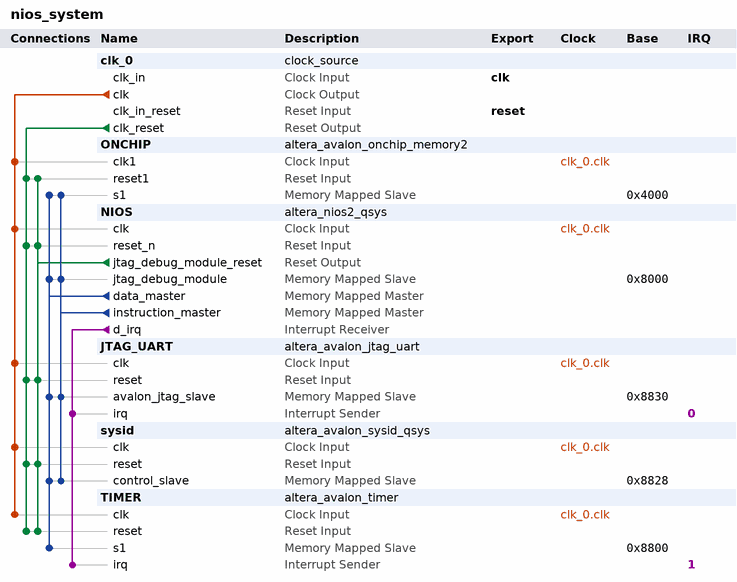
[diagram p0: system contents]
# Platform Designer (Qsys) system nios_system, Cyclone II EP2C20F484C7
# Parameters at their usual value, and those the tool derives, are not listed.
package require -exact qsys 13.0
create_system nios_system
set_project_property DEVICE_FAMILY {Cyclone II}
set_project_property DEVICE EP2C20F484C7

add_instance clk_0 clock_source 13.0
set_instance_parameter_value clk_0 clockFrequency 50000000

add_instance ONCHIP altera_avalon_onchip_memory2 13.0.1.99.2
set_instance_parameter_value ONCHIP dataWidth 32
set_instance_parameter_value ONCHIP dualPort false
set_instance_parameter_value ONCHIP initMemContent true
set_instance_parameter_value ONCHIP initializationFileName onchip_mem.hex
set_instance_parameter_value ONCHIP memorySize 16384

add_instance NIOS altera_nios2_qsys 13.0
set_instance_parameter_value NIOS resetSlave ONCHIP.s1
set_instance_parameter_value NIOS mmu_TLBMissExcSlave None
set_instance_parameter_value NIOS exceptionSlave ONCHIP.s1
set_instance_parameter_value NIOS breakSlave NIOS.jtag_debug_module
set_instance_parameter_value NIOS impl Fast
set_instance_parameter_value NIOS icache_size 2048

add_instance JTAG_UART altera_avalon_jtag_uart 13.0.1.99.2
set_instance_parameter_value JTAG_UART simInteractiveOptions NO_INTERACTIVE_WINDOWS

add_instance sysid altera_avalon_sysid_qsys 13.0
set_instance_parameter_value sysid id 0

add_instance TIMER altera_avalon_timer 13.0.1.99.2
set_instance_parameter_value TIMER period 10
set_instance_parameter_value TIMER periodUnits SEC

# connections
add_connection clk_0.clk JTAG_UART.clk clock
add_connection clk_0.clk NIOS.clk clock
add_connection clk_0.clk ONCHIP.clk1 clock
add_connection clk_0.clk sysid.clk clock
add_connection clk_0.clk TIMER.clk clock
add_connection clk_0.clk_reset JTAG_UART.reset reset
add_connection clk_0.clk_reset NIOS.reset_n reset
add_connection clk_0.clk_reset ONCHIP.reset1 reset
add_connection clk_0.clk_reset sysid.reset reset
add_connection clk_0.clk_reset TIMER.reset reset
add_connection NIOS.jtag_debug_module_reset JTAG_UART.reset reset
add_connection NIOS.jtag_debug_module_reset NIOS.reset_n reset
add_connection NIOS.jtag_debug_module_reset ONCHIP.reset1 reset
add_connection NIOS.jtag_debug_module_reset sysid.reset reset
add_connection NIOS.jtag_debug_module_reset TIMER.reset reset
add_connection NIOS.data_master JTAG_UART.avalon_jtag_slave avalon
set_connection_parameter_value NIOS.data_master/JTAG_UART.avalon_jtag_slave baseAddress 0x8830
add_connection NIOS.data_master NIOS.jtag_debug_module avalon
set_connection_parameter_value NIOS.data_master/NIOS.jtag_debug_module baseAddress 0x8000
add_connection NIOS.data_master ONCHIP.s1 avalon
set_connection_parameter_value NIOS.data_master/ONCHIP.s1 baseAddress 0x4000
add_connection NIOS.data_master sysid.control_slave avalon
set_connection_parameter_value NIOS.data_master/sysid.control_slave baseAddress 0x8828
add_connection NIOS.data_master TIMER.s1 avalon
set_connection_parameter_value NIOS.data_master/TIMER.s1 baseAddress 0x8800
add_connection NIOS.instruction_master JTAG_UART.avalon_jtag_slave avalon
set_connection_parameter_value NIOS.instruction_master/JTAG_UART.avalon_jtag_slave baseAddress 0x8830
add_connection NIOS.instruction_master NIOS.jtag_debug_module avalon
set_connection_parameter_value NIOS.instruction_master/NIOS.jtag_debug_module baseAddress 0x8000
add_connection NIOS.instruction_master ONCHIP.s1 avalon
set_connection_parameter_value NIOS.instruction_master/ONCHIP.s1 baseAddress 0x4000
add_connection NIOS.instruction_master sysid.control_slave avalon
set_connection_parameter_value NIOS.instruction_master/sysid.control_slave baseAddress 0x8828
add_connection NIOS.d_irq JTAG_UART.irq interrupt
set_connection_parameter_value NIOS.d_irq/JTAG_UART.irq irqNumber 0
add_connection NIOS.d_irq TIMER.irq interrupt
set_connection_parameter_value NIOS.d_irq/TIMER.irq irqNumber 1

# exported interfaces
add_interface clk clock sink
set_interface_property clk EXPORT_OF clk_0.clk_in
add_interface reset reset sink
set_interface_property reset EXPORT_OF clk_0.clk_in_reset

set_interconnect_requirement {$system} qsys_mm.clockCrossingAdapter HANDSHAKE
set_interconnect_requirement {$system} qsys_mm.maxAdditionalLatency 1

save_system nios_system.qsys
